# Vivado block design design_1, xc7z010clg400-1, Vivado 2020.2
create_bd_design design_1

create_bd_intf_port -mode Master -vlnv xilinx.com:interface:ddrx_rtl:1.0 DDR
create_bd_intf_port -mode Master -vlnv xilinx.com:display_processing_system7:fixedio_rtl:1.0 FIXED_IO
create_bd_intf_port -mode Slave -vlnv xilinx.com:interface:aximm_rtl:1.0 S_AXI_DMA
set_property -dict [list \
  CONFIG.ADDR_WIDTH 64 \
  CONFIG.ARUSER_WIDTH 0 \
  CONFIG.AWUSER_WIDTH 0 \
  CONFIG.BUSER_WIDTH 0 \
  CONFIG.DATA_WIDTH 128 \
  CONFIG.FREQ_HZ 25000000 \
  CONFIG.HAS_BRESP 1 \
  CONFIG.HAS_BURST 1 \
  CONFIG.HAS_CACHE 1 \
  CONFIG.HAS_LOCK 1 \
  CONFIG.HAS_PROT 1 \
  CONFIG.HAS_QOS 1 \
  CONFIG.HAS_REGION 1 \
  CONFIG.HAS_RRESP 1 \
  CONFIG.HAS_WSTRB 1 \
  CONFIG.ID_WIDTH 0 \
  CONFIG.MAX_BURST_LENGTH 256 \
  CONFIG.NUM_READ_OUTSTANDING 1 \
  CONFIG.NUM_READ_THREADS 1 \
  CONFIG.NUM_WRITE_OUTSTANDING 1 \
  CONFIG.NUM_WRITE_THREADS 1 \
  CONFIG.PROTOCOL AXI4 \
  CONFIG.READ_WRITE_MODE READ_WRITE \
  CONFIG.RUSER_BITS_PER_BYTE 0 \
  CONFIG.RUSER_WIDTH 0 \
  CONFIG.SUPPORTS_NARROW_BURST 1 \
  CONFIG.WUSER_BITS_PER_BYTE 0 \
  CONFIG.WUSER_WIDTH 0 \
] [get_bd_intf_ports S_AXI_DMA]
create_bd_intf_port -mode Master -vlnv xilinx.com:interface:gpio_rtl:1.0 select_gpio
create_bd_port -dir I -type clk dma_axi_aclk
set_property -dict [list \
  CONFIG.ASSOCIATED_BUSIF S_AXI_DMA \
  CONFIG.ASSOCIATED_RESET dma_axi_aresetn \
  CONFIG.FREQ_HZ 25000000 \
] [get_bd_ports dma_axi_aclk]
create_bd_port -dir I -type rst dma_axi_aresetn
set_property -dict {CONFIG.POLARITY ACTIVE_LOW} [get_bd_ports dma_axi_aresetn]

create_bd_cell -type ip -vlnv xilinx.com:ip:processing_system7:5.5 processing_system7_0
set_property -dict [list \
  CONFIG.PCW_APU_PERIPHERAL_FREQMHZ 650 \
  CONFIG.PCW_CRYSTAL_PERIPHERAL_FREQMHZ 50 \
  CONFIG.PCW_ENET0_ENET0_IO {MIO 16 .. 27} \
  CONFIG.PCW_ENET0_GRP_MDIO_ENABLE 1 \
  CONFIG.PCW_ENET0_GRP_MDIO_IO {MIO 52 .. 53} \
  CONFIG.PCW_ENET0_PERIPHERAL_ENABLE 1 \
  CONFIG.PCW_ENET0_RESET_ENABLE 1 \
  CONFIG.PCW_ENET0_RESET_IO {MIO 9} \
  CONFIG.PCW_ENET_RESET_ENABLE 1 \
  CONFIG.PCW_ENET_RESET_SELECT {Share reset pin} \
  CONFIG.PCW_FPGA0_PERIPHERAL_FREQMHZ 50 \
  CONFIG.PCW_FPGA1_PERIPHERAL_FREQMHZ 50 \
  CONFIG.PCW_GPIO_MIO_GPIO_ENABLE 1 \
  CONFIG.PCW_GPIO_MIO_GPIO_IO MIO \
  CONFIG.PCW_I2C_RESET_ENABLE 1 \
  CONFIG.PCW_PERIPHERAL_BOARD_PRESET None \
  CONFIG.PCW_PRESET_BANK1_VOLTAGE {LVCMOS 1.8V} \
  CONFIG.PCW_QSPI_PERIPHERAL_ENABLE 0 \
  CONFIG.PCW_SD0_GRP_CD_ENABLE 1 \
  CONFIG.PCW_SD0_GRP_CD_IO {MIO 47} \
  CONFIG.PCW_SD0_GRP_WP_ENABLE 0 \
  CONFIG.PCW_SD0_PERIPHERAL_ENABLE 1 \
  CONFIG.PCW_SD0_SD0_IO {MIO 40 .. 45} \
  CONFIG.PCW_SDIO_PERIPHERAL_FREQMHZ 100 \
  CONFIG.PCW_UART0_PERIPHERAL_ENABLE 1 \
  CONFIG.PCW_UART0_UART0_IO {MIO 14 .. 15} \
  CONFIG.PCW_UART1_PERIPHERAL_ENABLE 0 \
  CONFIG.PCW_UART_PERIPHERAL_FREQMHZ 100 \
  CONFIG.PCW_UIPARAM_DDR_BUS_WIDTH {16 Bit} \
  CONFIG.PCW_UIPARAM_DDR_FREQ_MHZ 525 \
  CONFIG.PCW_UIPARAM_DDR_PARTNO {MT41K256M16 RE-125} \
  CONFIG.PCW_USB0_PERIPHERAL_ENABLE 1 \
  CONFIG.PCW_USB0_RESET_ENABLE 1 \
  CONFIG.PCW_USB0_RESET_IO {MIO 46} \
  CONFIG.PCW_USB0_USB0_IO {MIO 28 .. 39} \
  CONFIG.PCW_USB_RESET_ENABLE 1 \
  CONFIG.PCW_USB_RESET_SELECT {Share reset pin} \
  CONFIG.PCW_USE_S_AXI_HP0 1 \
] [get_bd_cells processing_system7_0]
# 501 more settings of processing_system7_0 are not shown: defaults, MIO pin electricals, DDR timing, and values the tool derives
create_bd_cell -type ip -vlnv xilinx.com:ip:smartconnect:1.0 axi_smc_dma
set_property -dict {CONFIG.NUM_MI 1 CONFIG.NUM_SI 1} [get_bd_cells axi_smc_dma]
create_bd_cell -type ip -vlnv xilinx.com:ip:axi_gpio:2.0 axi_gpio_0
set_property -dict {CONFIG.C_ALL_OUTPUTS 1 CONFIG.C_GPIO_WIDTH 2} [get_bd_cells axi_gpio_0]
create_bd_cell -type ip -vlnv xilinx.com:ip:axi_interconnect:2.1 ps7_0_axi_periph
set_property -dict {CONFIG.NUM_MI 1} [get_bd_cells ps7_0_axi_periph]
create_bd_cell -type ip -vlnv xilinx.com:ip:proc_sys_reset:5.0 rst_ps7_0_50M

# ---- connections ----

connect_bd_intf_net [get_bd_intf_ports DDR] [get_bd_intf_pins processing_system7_0/DDR]
connect_bd_intf_net [get_bd_intf_pins axi_smc_dma/M00_AXI] [get_bd_intf_pins processing_system7_0/S_AXI_HP0]
connect_bd_intf_net [get_bd_intf_ports S_AXI_DMA] [get_bd_intf_pins axi_smc_dma/S00_AXI]
# interface net axi_smc_dma_M00_AXI has one end: 
connect_bd_intf_net [get_bd_intf_ports FIXED_IO] [get_bd_intf_pins processing_system7_0/FIXED_IO]
connect_bd_intf_net [get_bd_intf_pins processing_system7_0/M_AXI_GP0] [get_bd_intf_pins ps7_0_axi_periph/S00_AXI]
connect_bd_intf_net [get_bd_intf_pins ps7_0_axi_periph/M00_AXI] [get_bd_intf_pins axi_gpio_0/S_AXI]
connect_bd_intf_net [get_bd_intf_ports select_gpio] [get_bd_intf_pins axi_gpio_0/GPIO]
connect_bd_net [get_bd_ports dma_axi_aclk] [get_bd_pins axi_smc_dma/aclk] [get_bd_pins processing_system7_0/S_AXI_HP0_ACLK]
connect_bd_net [get_bd_ports dma_axi_aresetn] [get_bd_pins axi_smc_dma/aresetn]
connect_bd_net [get_bd_pins processing_system7_0/FCLK_CLK0] \
  [get_bd_pins processing_system7_0/M_AXI_GP0_ACLK] [get_bd_pins ps7_0_axi_periph/S00_ACLK] \
  [get_bd_pins rst_ps7_0_50M/slowest_sync_clk] [get_bd_pins axi_gpio_0/s_axi_aclk] [get_bd_pins ps7_0_axi_periph/M00_ACLK] \
  [get_bd_pins ps7_0_axi_periph/ACLK]
connect_bd_net [get_bd_pins processing_system7_0/FCLK_RESET0_N] [get_bd_pins rst_ps7_0_50M/ext_reset_in]
connect_bd_net [get_bd_pins rst_ps7_0_50M/peripheral_aresetn] \
  [get_bd_pins ps7_0_axi_periph/S00_ARESETN] [get_bd_pins axi_gpio_0/s_axi_aresetn] \
  [get_bd_pins ps7_0_axi_periph/M00_ARESETN] [get_bd_pins ps7_0_axi_periph/ARESETN]
set_property HDL_ATTRIBUTE.DEBUG true [get_bd_intf_nets axi_smc_dma_M00_AXI]
set_property HDL_ATTRIBUTE.MARK_DEBUG true [get_bd_intf_nets axi_smc_dma_M00_AXI]

# ---- address map ----
assign_bd_address -offset 0x41200000 -range 64K -target_address_space [get_bd_addr_spaces processing_system7_0/Data] [get_bd_addr_segs axi_gpio_0/S_AXI/Reg]
assign_bd_address -offset 0x0000000000000000 -range 512M -target_address_space [get_bd_addr_spaces S_AXI_DMA] [get_bd_addr_segs processing_system7_0/S_AXI_HP0/HP0_DDR_LOWOCM]

validate_bd_design
save_bd_design
